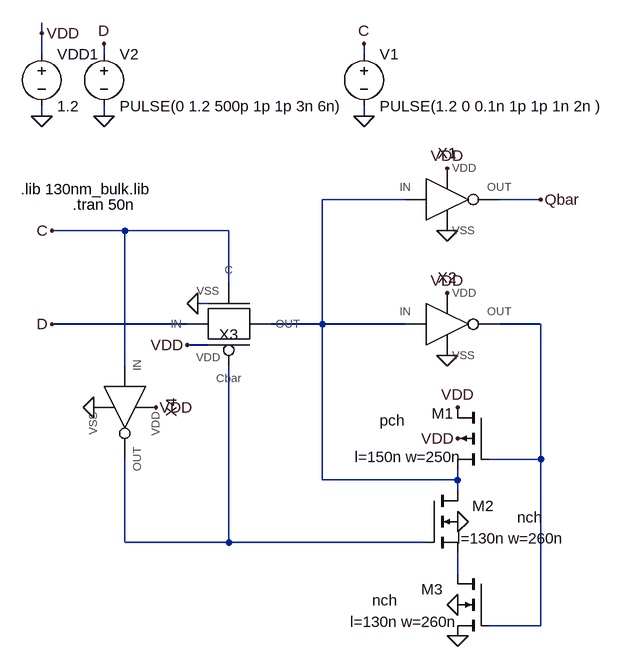
[diagram p0: schematic Prob5.asc]
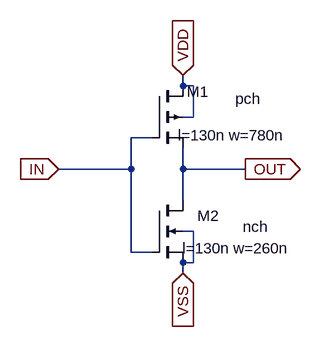
[diagram p1: sub-circuit inverter1.asc]
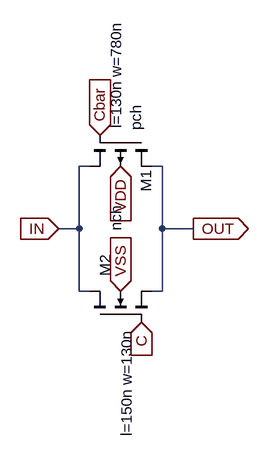
[diagram p2: sub-circuit tg.asc]
Prob5.asc, the LTspice schematic file:
Version 4.1
SHEET 1 880 916
WIRE -400 -96 -400 -112
WIRE -400 -64 -400 -96
WIRE -304 -64 -304 -80
WIRE 96 -64 96 -80
WIRE -400 32 -400 16
WIRE -304 32 -304 16
WIRE 96 32 96 16
WIRE 160 160 32 160
WIRE 368 160 304 160
WIRE -272 208 -384 208
WIRE -112 208 -272 208
WIRE -112 288 -112 208
WIRE -144 320 -160 320
WIRE -176 352 -384 352
WIRE 32 352 32 160
WIRE 32 352 -48 352
WIRE 160 352 32 352
WIRE 368 352 304 352
WIRE -144 384 -176 384
WIRE -272 416 -272 208
WIRE 368 560 368 352
WIRE 368 560 288 560
WIRE 32 592 32 352
WIRE 240 592 240 576
WIRE 240 592 32 592
WIRE 240 608 240 592
WIRE -272 688 -272 560
WIRE -112 688 -112 416
WIRE -112 688 -272 688
WIRE 192 688 -112 688
WIRE 240 736 240 704
WIRE 368 816 368 560
WIRE 368 816 288 816
FLAG 240 832 0
FLAG 240 784 0
FLAG 240 656 0
FLAG 240 480 VDD
FLAG 240 528 VDD
FLAG 224 112 VDD
FLAG 224 304 VDD
FLAG -176 384 VDD
FLAG -224 480 VDD
FLAG -160 320 0
FLAG -320 480 0
FLAG 96 32 0
FLAG 96 -80 C
FLAG -304 32 0
FLAG -304 -80 D
FLAG -384 208 C
FLAG -384 352 D
FLAG 368 160 Qbar
FLAG -400 32 0
FLAG -400 -96 VDD
FLAG 224 208 0
FLAG 224 400 0
SYMBOL Inverter1 224 160 R0
SYMATTR InstName X1
SYMBOL Inverter1 224 352 R0
SYMATTR InstName X2
SYMBOL TG -112 352 M180
SYMATTR InstName X3
SYMBOL Inverter1 -272 480 R90
SYMATTR InstName X4
SYMBOL pmos4 288 480 M0
WINDOW 0 88 9 Right 2
WINDOW 3 168 20 Right 2
WINDOW 123 206 76 Right 2
SYMATTR InstName M1
SYMATTR Value pch
SYMATTR Value2 l=150n w=250n
SYMBOL nmos4 192 608 R0
WINDOW 0 104 24 Right 2
WINDOW 3 179 41 Right 2
WINDOW 123 213 74 Right 2
SYMATTR InstName M2
SYMATTR Value nch
SYMATTR Value2 l=130n w=260n
SYMBOL nmos4 288 736 M0
WINDOW 0 104 24 Right 2
WINDOW 3 179 41 Right 2
WINDOW 123 213 74 Right 2
SYMATTR InstName M3
SYMATTR Value nch
SYMATTR Value2 l=130n w=260n
SYMBOL voltage 96 -80 R0
WINDOW 123 0 0 Left 0
WINDOW 39 0 0 Left 0
SYMATTR InstName V1
SYMATTR Value PULSE(1.2 0 0.1n 1p 1p 1n 2n )
SYMBOL voltage -304 -80 R0
WINDOW 123 0 0 Left 0
WINDOW 39 0 0 Left 0
SYMATTR InstName V2
SYMATTR Value PULSE(0 1.2 500p 1p 1p 3n 6n)
SYMBOL voltage -400 -80 R0
WINDOW 123 0 0 Left 2
WINDOW 39 0 0 Left 2
SYMATTR InstName VDD1
SYMATTR Value 1.2
TEXT -432 144 Left 2 !.lib 130nm_bulk.lib
TEXT -352 168 Left 2 !.tran 50n

inverter1.asc, the sub-circuit schematic file:
Version 4.1
SHEET 1 880 680
WIRE 176 32 176 16
WIRE 192 32 176 32
WIRE 192 80 192 32
WIRE 192 80 176 80
WIRE 128 112 96 112
WIRE 96 160 96 112
WIRE 96 160 -16 160
WIRE 176 160 176 128
WIRE 272 160 176 160
WIRE 176 208 176 160
WIRE 192 256 176 256
WIRE 96 288 96 160
WIRE 128 288 96 288
WIRE 192 304 192 256
WIRE 192 304 176 304
WIRE 176 320 176 304
FLAG -16 160 IN
IOPIN -16 160 In
FLAG 176 16 VDD
IOPIN 176 16 In
FLAG 176 320 VSS
IOPIN 176 320 In
FLAG 272 160 OUT
IOPIN 272 160 Out
SYMBOL pmos4 128 32 R0
WINDOW 0 88 9 Right 2
WINDOW 3 168 20 Right 2
WINDOW 123 206 76 Right 2
SYMATTR InstName M1
SYMATTR Value pch
SYMATTR Value2 l=130n w=780n
SYMBOL nmos4 128 208 R0
WINDOW 0 104 24 Right 2
WINDOW 3 179 41 Right 2
WINDOW 123 213 74 Right 2
SYMATTR InstName M2
SYMATTR Value nch
SYMATTR Value2 l=130n w=260n

tg.asc, the sub-circuit schematic file:
Version 4.1
SHEET 1 2188 680
WIRE 1920 -128 1904 -128
WIRE 2032 -128 2016 -128
WIRE 1904 -32 1904 -128
WIRE 1904 -32 1872 -32
WIRE 2032 -32 2032 -128
WIRE 2080 -32 2032 -32
WIRE 1904 64 1904 -32
WIRE 1920 64 1904 64
WIRE 2032 64 2032 -32
WIRE 2032 64 2016 64
FLAG 1936 -176 Cbar
IOPIN 1936 -176 In
FLAG 2000 112 C
IOPIN 2000 112 In
FLAG 1872 -32 IN
IOPIN 1872 -32 In
FLAG 2080 -32 OUT
IOPIN 2080 -32 Out
FLAG 1968 -128 VDD
IOPIN 1968 -128 In
FLAG 1968 64 VSS
IOPIN 1968 64 In
SYMBOL pmos4 2016 -176 R90
WINDOW 0 88 9 Right 2
WINDOW 3 -7 24 Right 2
WINDOW 123 -10 55 Right 2
SYMATTR InstName M1
SYMATTR Value pch
SYMATTR Value2 l=130n w=780n
SYMBOL nmos4 1920 112 R270
WINDOW 0 104 24 Right 2
WINDOW 3 179 41 Right 2
WINDOW 123 -10 57 Right 2
SYMATTR InstName M2
SYMATTR Value nch
SYMATTR Value2 l=150n w=130n

The netlist it stands for:
* Prob5.asc
X§X1 N001 VDD 0 Qbar inverter1
X§X2 N001 VDD 0 N002 inverter1
X§X3 C N003 D VDD 0 N001 tg
X§X4 C VDD 0 N003 inverter1
M1 VDD N002 N001 VDD pch l=150n w=250n
M2 N001 N003 N004 0 nch l=130n w=260n
M3 N004 N002 0 0 nch l=130n w=260n
V1 C 0 PULSE(1.2 0 0.1n 1p 1p 1n 2n )
V2 D 0 PULSE(0 1.2 500p 1p 1p 3n 6n)
VDD1 VDD 0 1.2

* block symbol definitions
.subckt inverter1 IN VDD VSS OUT
M1 VDD IN OUT VDD pch l=130n w=780n
M2 OUT IN VSS VSS nch l=130n w=260n
.ends inverter1

.subckt tg C Cbar IN VDD VSS OUT
M1 OUT Cbar IN VDD pch l=130n w=780n
M2 IN C OUT VSS nch l=150n w=130n
.ends tg

.model NMOS NMOS
.model PMOS PMOS
.lib standard.mos
.lib 130nm_bulk.lib
.tran 50n
.backanno
.end